# Altium schematic sheet [02] Amplier.SchDoc
size A
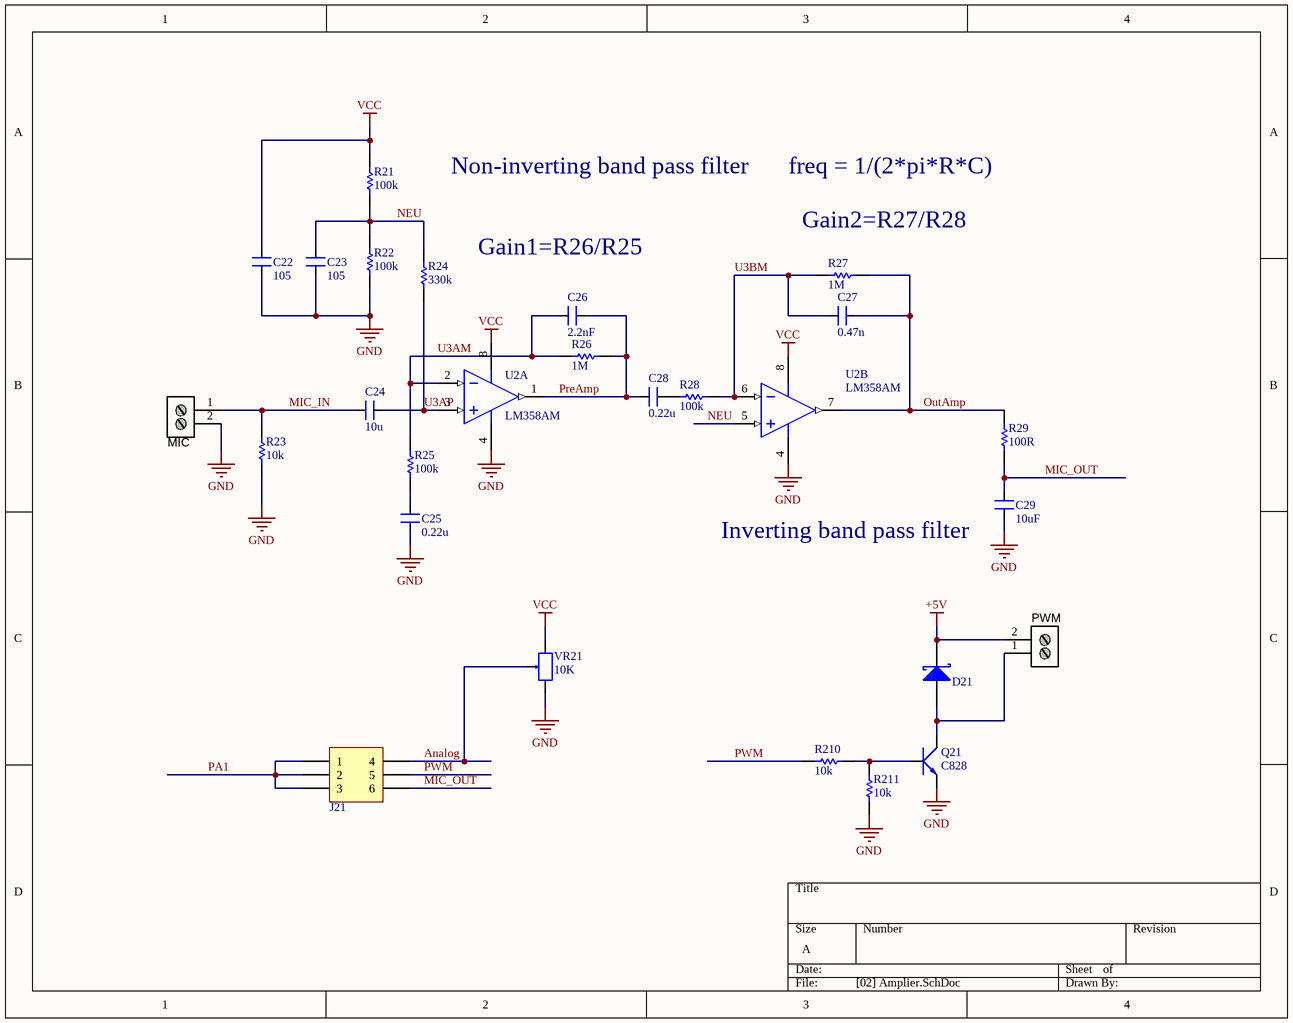
[diagram p0: [02] Amplier.SchDoc]

## Parts
C22  value 105  [CAPC2012N_F]  (hidden comment: CAP NP)
C23  value 105  [CAPC2012N_F]  (hidden comment: CAP NP)
C24  value 10u  [CAPC2012N_F]  (hidden comment: CAP NP)
C25  value 0.22u  [CAPC2012N_F]  (hidden comment: CAP NP)
C26  value 2.2nF  [CAPC2012N_F]  (hidden comment: CAP NP)
C27  value 0.47n  [CAPC2012N_F]  (hidden comment: CAP NP)
C28  value 0.22u  [CAPC2012N_F]  (hidden comment: CAP NP)
C29  value 10uF  [CAPC2012N_F]  (hidden comment: CAP NP)
D21  Diode  [DO-214AC]  (value not drawn)
J21  Header 3X2A  [HDR2X3_CEN]  (value not drawn)
MIC  Stackable ScrewTerm  [2P_PCB_ScrewTerm_200mil]  (value not drawn)
PWM  Stackable ScrewTerm  [2P_PCB_ScrewTerm_200mil]  (value not drawn)
Q21  C828  [SOT23 TOP]
R21  value 100k  [RESC2012N_F]  (hidden comment: Res)
R22  value 100k  [RESC2012N_F]  (hidden comment: Res)
R23  value 10k  [RESC2012N_F]  (hidden comment: Res)
R24  value 330k  [RESC2012N_F]  (hidden comment: Res)
R25  value 100k  [RESC2012N_F]  (hidden comment: Res)
R26  value 1M  [RESC2012N_F]  (hidden comment: Res)
R27  value 1M  [RESC2012N_F]  (hidden comment: Res)
R28  value 100k  [RESC2012N_F]  (hidden comment: Res)
R29  value 100R  [RESC2012N_F]  (hidden comment: Res)
R210  value 10k  [RESC1608N_ZERO]  (hidden comment: Res)
R211  value 10k  [RESC1608N_ZERO]  (hidden comment: Res)
U2  LM358AM  [M08A_N]  (parts A,B of 2)
VR21  10K  [VR1]

## Nets
+5V: D21.2(K) PWM.2
GND: C22.1 C23.1 C25.1 C29.2 MIC.2 Q21.3(E) R22.1 R23.2 R211.1 U2.4(GND) VR21.1
VCC: C22.2 R21.2 U2.8(V+) VR21.3
Analog: J21.4 VR21.2
MIC_IN: C24.2 MIC.1 R23.1
MIC_OUT: C29.1 J21.6 R29.1
NEU: C23.2 R21.1 R22.2 R24.1 U2.5(INB+)
OutAmp: C27.1 R27.1 R29.2 U2.7(OUTB)
PA1: J21.1 J21.2 J21.3
PreAmp: C26.1 C28.2 R26.1 U2.1(OUTA)
PWM: J21.5 R210.1
U3AM: C26.2 R25.1 R26.2 U2.2(INA-)
U3AP: C24.1 R24.2 U2.3(INA+)
U3BM: C27.2 R27.2 R28.2 U2.6(INB-)
NetC25_2: C25.2 R25.2
NetC28_1: C28.1 R28.1
NetD21_1: D21.1(A) PWM.1 Q21.2(C)
NetQ21_1: Q21.1(B) R210.2 R211.2

## Notes on the sheet
- Non-inverting band pass filter
- freq = 1/(2*pi*R*C)
- (near R27) Gain2=R27/R28
- Gain1=R26/R25
- (near C29) Inverting band pass filter

## Library data of the parts
D21 = Diode: pin to pad: 1>A 2>K
J21 = Header 3X2A: Header, 3-Pin, Dual row; LatestRevisionDate: 17-Jul-2002; LatestRevisionNote: Re-released for DXP Platform.; Publisher: Altium Limited
MIC PWM = 2P_ScrewTerm_90S_3.81MM: Terminal Block Screw Type THT 2-Position 3.81mm pitch; Manufacturer 1: Tyco Electronics; Manufacturer Part Number 1: 1776113-2; Value: 2 position; Pitch: 0.150" (3.81mm); Positions Per Level: 2; Package / Case: Side Entry; 3.81mm pitch; Category: Connectors Interconnects; Color: Black; Supplier 1: Digi-Key; Supplier Part Number 1: A97976-ND
Q21 = NPN: Transistor C828 C1815....
U2 = LM358AM: Low Power Dual Operational Amplifier; Manufacturer: National Semiconductor; CompType: Amplifiers; PackageTopMarking: NSZXTT*LM*358AM; PowerWise: N; Published: 4-Dec-2008; LatestRevisionDate: 13-Jan-2009; LatestRevisionNote: Sim Model Added.; DatasheetVersion: Oct-2005; PackageVersion: revL, Sep-2006; PackageReference: M08A; Publisher: Altium Limited; PackageDescription: SOIC Narrow, 4.9 x 3.9 x 1.45mm, 8 Lead, 1.27mm Pitch; PartNumber: LM358AM; RoHS: O; PinCount: 8; DigiKeyPartNumber: LM358AMXCT-ND; Code_JEDEC: MS-012-AA; Code_IPC: SOIC127P600-8; ComponentLink1Description: LM358 Datasheet; ComponentLink1URL: http://www.national.com/ds/LM/LM358.pdf; ComponentLink2Description: LM358 Web Page; ComponentLink2URL: http://www.national.com/pf/LM/LM358.html; ComponentLink3Description: M08A Package Page; ComponentLink3URL: http://www.national.com/packaging/folders/m08a.html
VR21 = VR: Var Resistor; Value: VR 10K